# EAGLE design servoshifter (EAGLE 6.0)
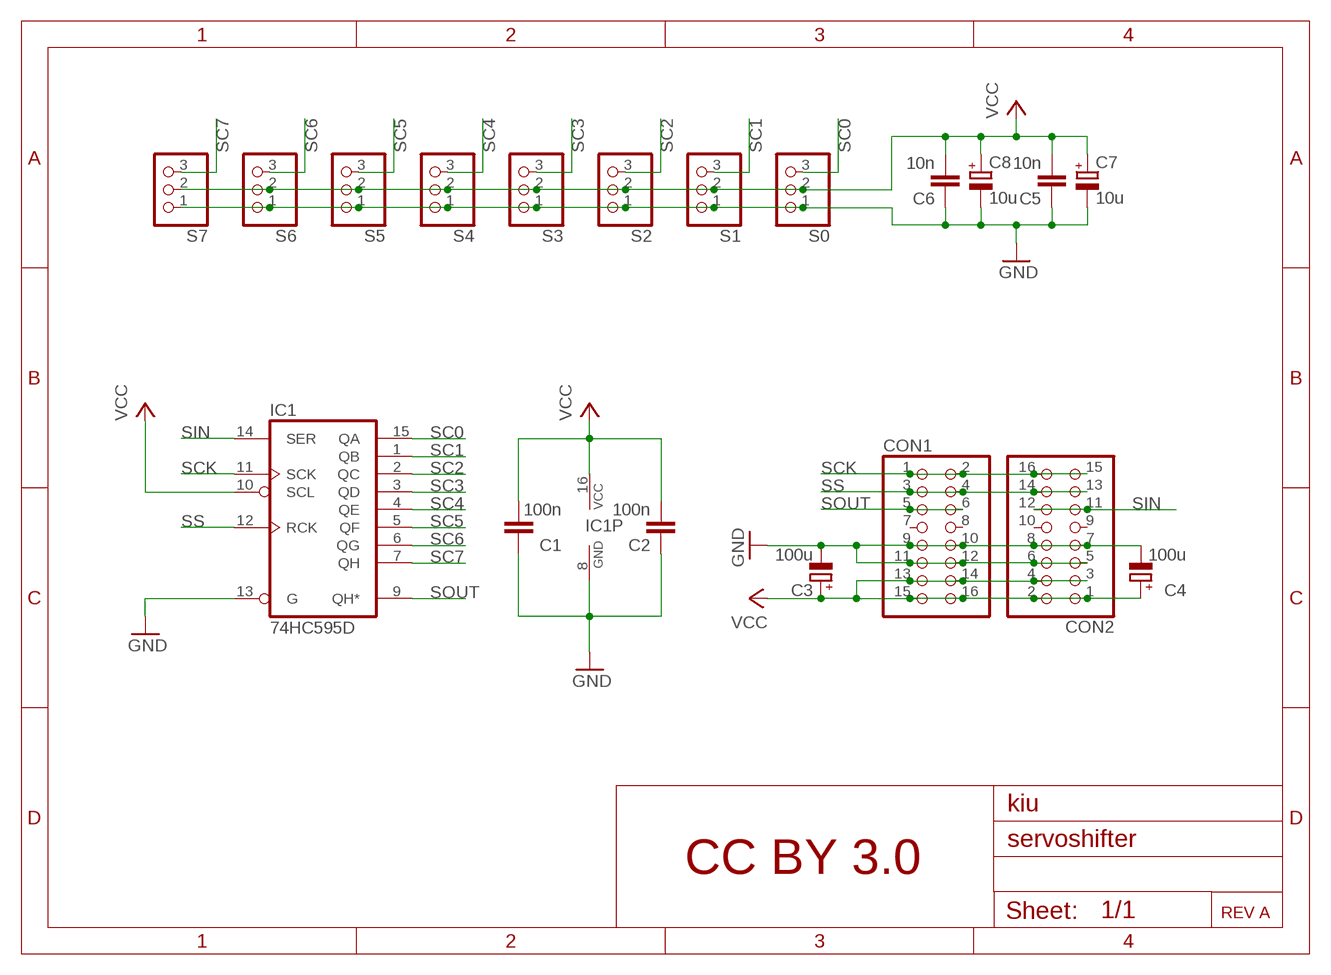
[diagram p0: schematic, sheet 1]

## Parts
C1  100n  C-EUC0805  [C0805]
C2  100n  C-EUC0805  [C0805]
C3  100u  CPOL-EU153CLV-0505  [153CLV-0505]
C4  100u  CPOL-EU153CLV-0505  [153CLV-0505]
C5  10n  C-EUC0805  [C0805]
C6  10n  C-EUC0805  [C0805]
C7  10u  CPOL-EU153CLV-0405  [153CLV-0405]
C8  10u  CPOL-EU153CLV-0405  [153CLV-0405]
CON1  PINHD-2X8  [2X08]
CON2  PINHD-2X8  [2X08]
IC1  74HC595D  [SO16]
S0  PINHD-1X3  [1X03]
S1  PINHD-1X3  [1X03]
S2  PINHD-1X3  [1X03]
S3  PINHD-1X3  [1X03]
S4  PINHD-1X3  [1X03]
S5  PINHD-1X3  [1X03]
S6  PINHD-1X3  [1X03]
S7  PINHD-1X3  [1X03]

## Nets
GND: C1.1 C2.1 C3.- C4.- C5.1 C6.1 C7.- C8.- CON1.9 CON1.10 CON1.11 CON1.12 CON2.5 CON2.6 CON2.7 CON2.8 IC1.8(GND) IC1.13(G) S0.1 S1.1 S2.1 S3.1 S4.1 S5.1 S6.1 S7.1
SC0: IC1.15(QA) S0.3
SC1: IC1.1(QB) S1.3
SC2: IC1.2(QC) S2.3
SC3: IC1.3(QD) S3.3
SC4: IC1.4(QE) S4.3
SC5: IC1.5(QF) S5.3
SC6: IC1.6(QG) S6.3
SC7: IC1.7(QH) S7.3
SCK: CON1.1 CON1.2 CON2.15 CON2.16 IC1.11(SCK)
SIN: CON2.11 CON2.12 IC1.14(SER)
SOUT: CON1.5 CON1.6 IC1.9(QH*)
SS: CON1.3 CON1.4 CON2.13 CON2.14 IC1.12(RCK)
VCC: C1.2 C2.2 C3.+ C4.+ C5.2 C6.2 C7.+ C8.+ CON1.13 CON1.14 CON1.15 CON1.16 CON2.1 CON2.2 CON2.3 CON2.4 IC1.10(SCL) IC1.16(VCC) S0.2 S1.2 S2.2 S3.2 S4.2 S5.2 S6.2 S7.2
Unconnected: CON1.7 CON1.8 CON2.9 CON2.10

## Notes on the sheet
- kiu
- CC BY 3.0
- REV A

## Library data of the parts
C1 C2 C5 C6 = rcl:C-EU: CAPACITOR, European symbol
C3 C4 C7 C8 = rcl:CPOL-EU: POLARIZED CAPACITOR, European symbol
CON1 CON2 = pinhead:PINHD-2X8: PIN HEADER
IC1 = 74xx-eu:74*595: 8-bit SHIFT REGISTER, output latch
S0 S1-S7 = pinhead:PINHD-1X3: PIN HEADER

## Board
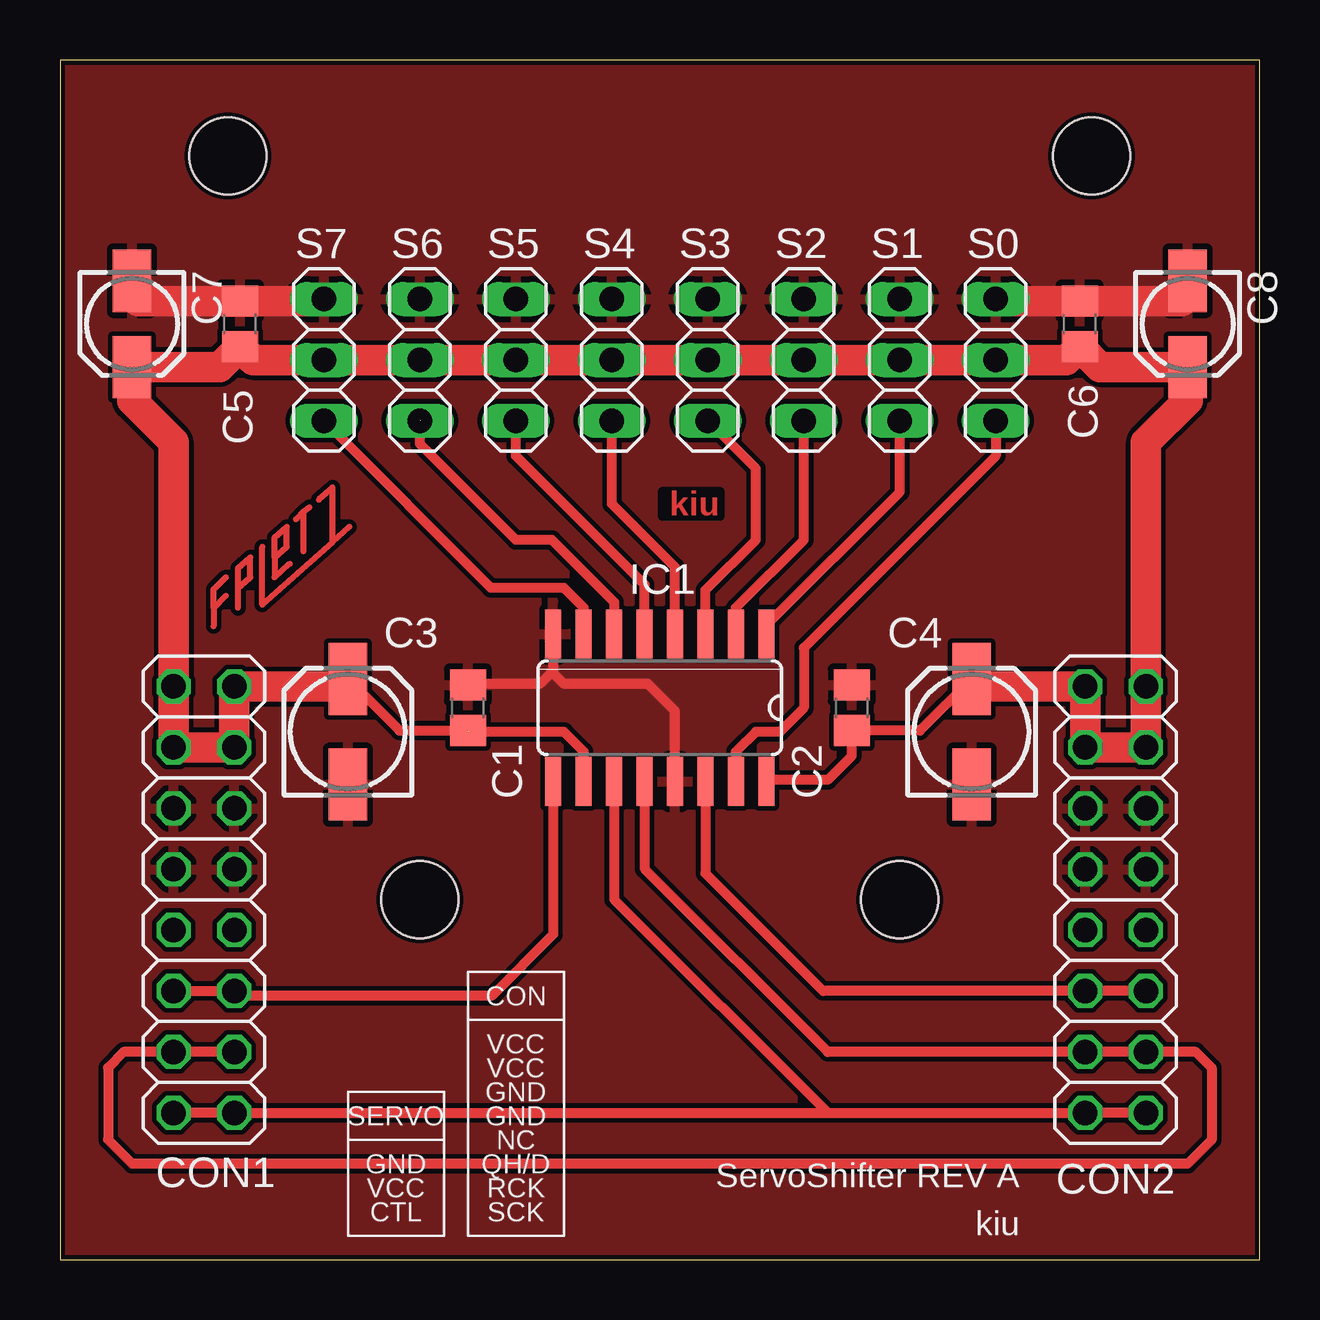
[diagram p1: board, top side]
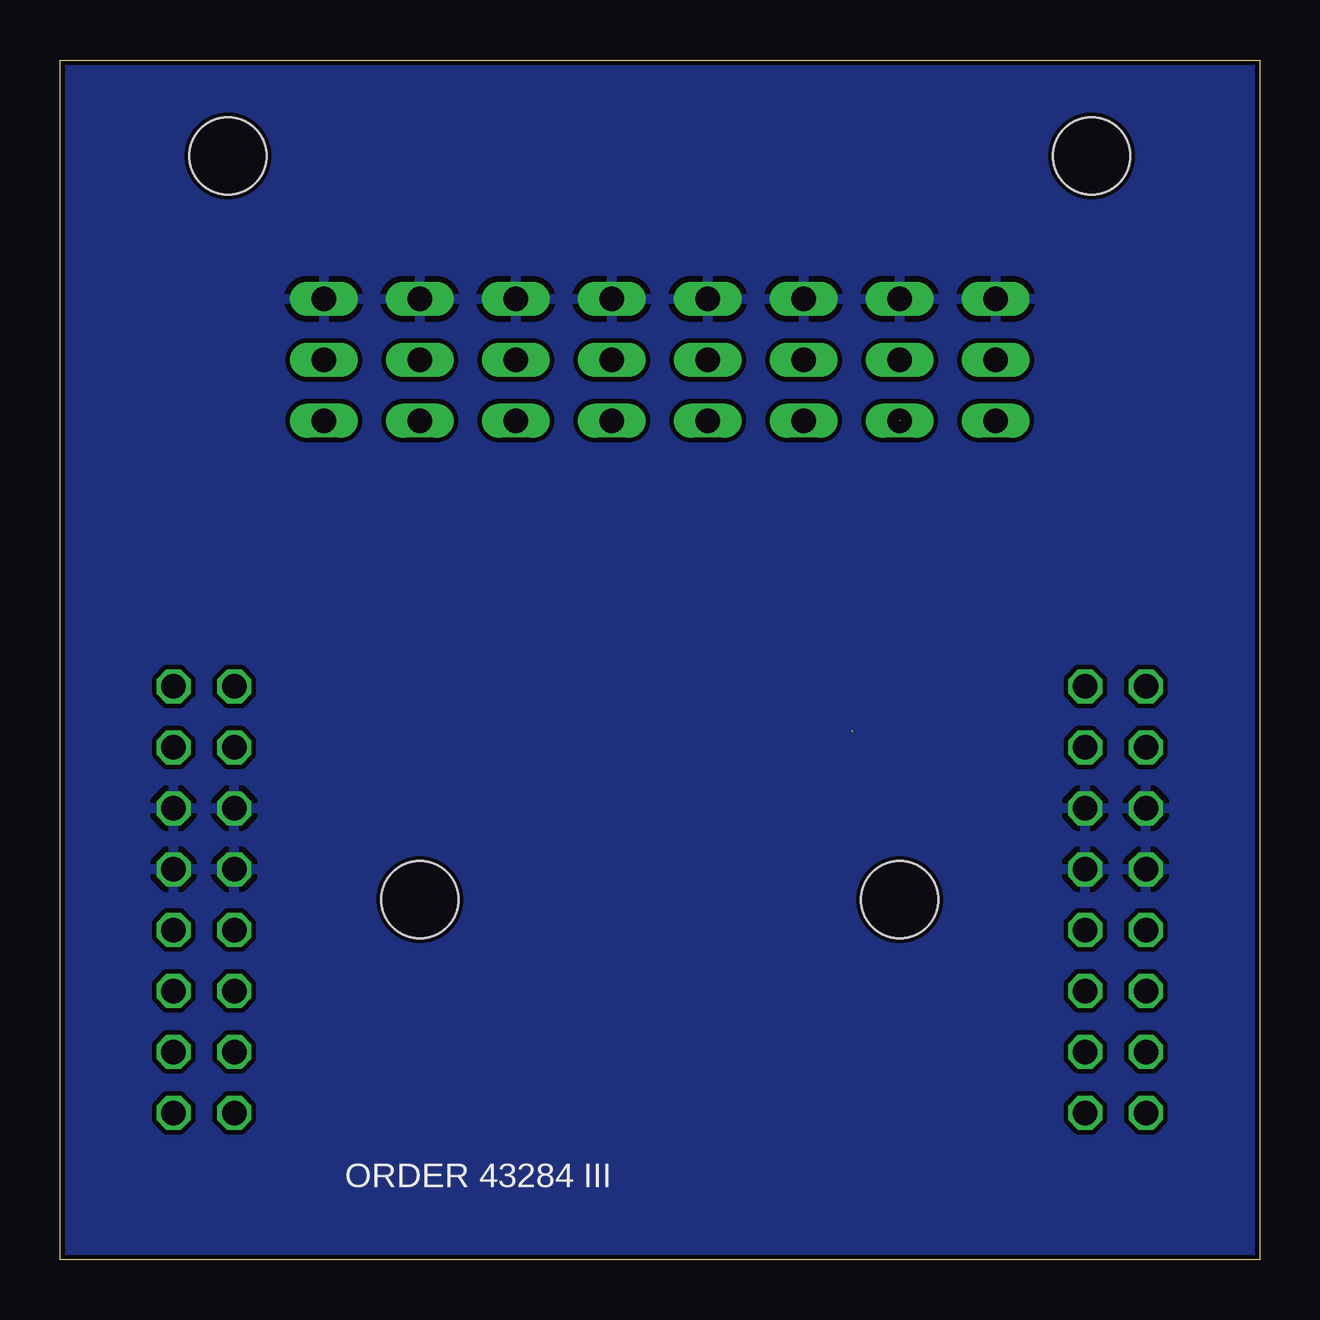
[diagram p2: board, bottom side, seen from below]

Size 50 x 50 mm. Coordinates in mm from the lower left corner, seen from the top.
Outline: 0,0 50,0 50,50 0,50 0,0
Copper layers (1*16): Top 0.035mm / dielectric 1.5mm / Bottom 0.035mm
Design rules: minimum track width 0.2mm, minimum drill 0.5mm, track to track 0.2mm, track to pad 0.2mm, pad to pad 0.15mm, via to via 0.2mm, smd to smd 0mil, copper to edge 0.2mm, drill to drill 0.2mm, minimum pad ring 0.2mm, minimum via ring 0.2mm, stop-mask expansion 0.1mm, vias tented up to drill 0mil, thermal gap 10mil
Holes 3.2 mm at 7,46 43,46 35,15 15,15

### Footprints (pad centres in the part's own frame; a part is rotated, then mirrored left to right if it is on the bottom)
C0805 = smd 1.3 x 1.5: 1 -0.95,0; 2 0.95,0
153CLV-0505 = smd 3 x 1.6: + 2.2,0; - -2.2,0
153CLV-0405 = smd 2.6 x 1.6: + 1.8,0; - -1.8,0
2X08 = drill 1.016 octagon: 1 -8.89,-1.27; 2 -8.89,1.27; 3 -6.35,-1.27; 4 -6.35,1.27; 5 -3.81,-1.27; 6 -3.81,1.27; 7 -1.27,-1.27; 8 -1.27,1.27; 9 1.27,-1.27; 10 1.27,1.27; 11 3.81,-1.27; 12 3.81,1.27; 13 6.35,-1.27; 14 6.35,1.27; 15 8.89,-1.27; 16 8.89,1.27
SO16 = smd 0.66 x 2.032: 1 -4.445,-3.073; 2 -3.175,-3.073; 3 -1.905,-3.073; 4 -0.635,-3.073; 5 0.635,-3.073; 6 1.905,-3.073; 7 3.175,-3.073; 8 4.445,-3.073; 9 4.445,3.073; 10 3.175,3.073; 11 1.905,3.073; 12 0.635,3.073; 13 -0.635,3.073; 14 -1.905,3.073; 15 -3.175,3.073; 16 -4.445,3.073
1X03 = drill 1.016 long: 1 -2.54,0; 2 0,0; 3 2.54,0

### Placement (x,y rotation side)
C1  17,23 270 top
C2  33,23 270 top
C3  12,22 90 top
C4  38,22 90 top
C5  7.5,39 270 top
C6  42.5,39 270 top
C7  3,39 270 top
C8  47,39 270 top
CON1  6,15 90 top
CON2  44,15 270 top
IC1  25,23 180 top
S0  39,37.5 270 top
S1  35,37.5 270 top
S2  31,37.5 270 top
S3  27,37.5 270 top
S4  23,37.5 270 top
S5  19,37.5 270 top
S6  15,37.5 270 top
S7  11,37.5 270 top

### Tracks (layer width: path | path; a pad name or v marks a point on that pad's centre or on a via)
GND
  Top 0.406: IC1.8 20.55,24.55 20.5,24.5 | 20.5,24.5 20,24 17.05,24 | IC1.13 25.64,22.86 24.5,24 21,24 20.5,24.5 | C3.- 12,21 | 33.05,24 C2.1
  Top 1.27: S0.1 39.09,39.95 C6.1 46.75,39.95 | S7.1 10.91,39.95 C5.1 3.25,39.95
  pour Bottom: -1,-1 51,-1 51,51 -1,51
  pour Top: -1,-1 51,-1 51,51 -1,51
N$13
  Top 0.254: 7.42,27.99 7.42,28.82 7.93,29.26 7.93,28.44 7.42,27.99 | 7.42,27.17 7.42,27.99
N$14
  Top 0.254: 8.44,29.71 8.44,27.29 11.36,29.9 | 10.79,31.68 11.36,32.18 11.36,29.9 | 11.36,29.9 12.06,30.53
N$15
  Top 0.254: 9.58,29.01 8.94,28.44 8.94,29.26 | 8.94,29.26 8.94,30.09 9.45,30.53 9.45,29.71 8.94,29.26
N$16
  Top 0.254: 10.15,31.17 9.83,30.85 | 10.15,29.52 10.15,31.17 | 10.15,31.17 10.4,31.36
N$19
  Top 0.254: 6.91,28.44 6.4,27.93 6.4,27.17 | 6.4,27.17 6.4,26.4 | 6.4,27.17 6.91,27.67
SC0
  Top 0.406: S0.3 39,33.5 31,25.5 31,23 30,22 29,22 28.18,21.18 IC1.15
SC1
  Top 0.406: IC1.1 29.45,26.45 35,32 S1.3
SC2
  Top 0.406: IC1.2 28.18,27.18 31,30 S2.3
SC3
  Top 0.406: IC1.3 26.91,27.91 29,30 29,32.96 S3.3
SC4
  Top 0.406: IC1.4 25.64,28.86 23,31.5 S4.3
SC5
  Top 0.406: IC1.5 24.36,28.14 19,33.5 S5.3
SC6  (1 unrouted)
  Top 0.406: 23,26.17 IC1.6 23.09,27.41 20.5,30 19,30 15,34 15,35
SC7
  Top 0.406: IC1.7 21.82,27.18 21,28 17.96,28 S7.3
SCK
  Top 0.406: CON1.2 CON1.1 32,6.11 | IC1.11 23.09,15.02 32,6.11 | CON2.16 CON2.15 32,6.11
SIN
  Top 0.406: IC1.14 26.91,16.09 31.81,11.19 CON2.11 CON2.12
SOUT
  Top 0.406: CON1.6 CON1.5 7.54,11 18,11 20.55,13.55 IC1.9
SS
  Top 0.406: IC1.12 24.36,16.29 32,8.65 CON2.13 CON2.14 47.35,8.65 48,8 48,5 47,4 3,4 2,5 2,8 2.65,8.65 CON1.4 CON1.3
VCC  (1 unrouted)
  Top 0.406: IC1.10 21.82,21.18 21,22 17,22 | IC1.16 29.52,20 32,20 33,21 C2.2 35.85,22.05 C4.+ | C3.+ 14.15,22.05 C1.2
  Top 1.27: C3.+ 11.69,23.89 CON1.15 CON1.13 CON1.14 CON1.16 4.73,34.07 3,35.8 C7.+ 6.65,37.2 C5.2 8.05,37.5 S7.2 S6.2 S5.2 S4.2 S3.2 S2.2 S1.2 S0.2 41.95,37.5 C6.2 43.35,37.2 C8.+ 47,35.8 45.27,34.07 CON2.2 CON2.4 CON2.3 CON2.1 38.31,23.89 C4.+

### Text on the board
Top: kiu
tNames: CON | VCC | VCC | GND | SERVO | GND | NC | GND | QH/D | VCC | RCK | ServoShifter REV A | CTL | SCK | kiu
bNames: ORDER 43284 III